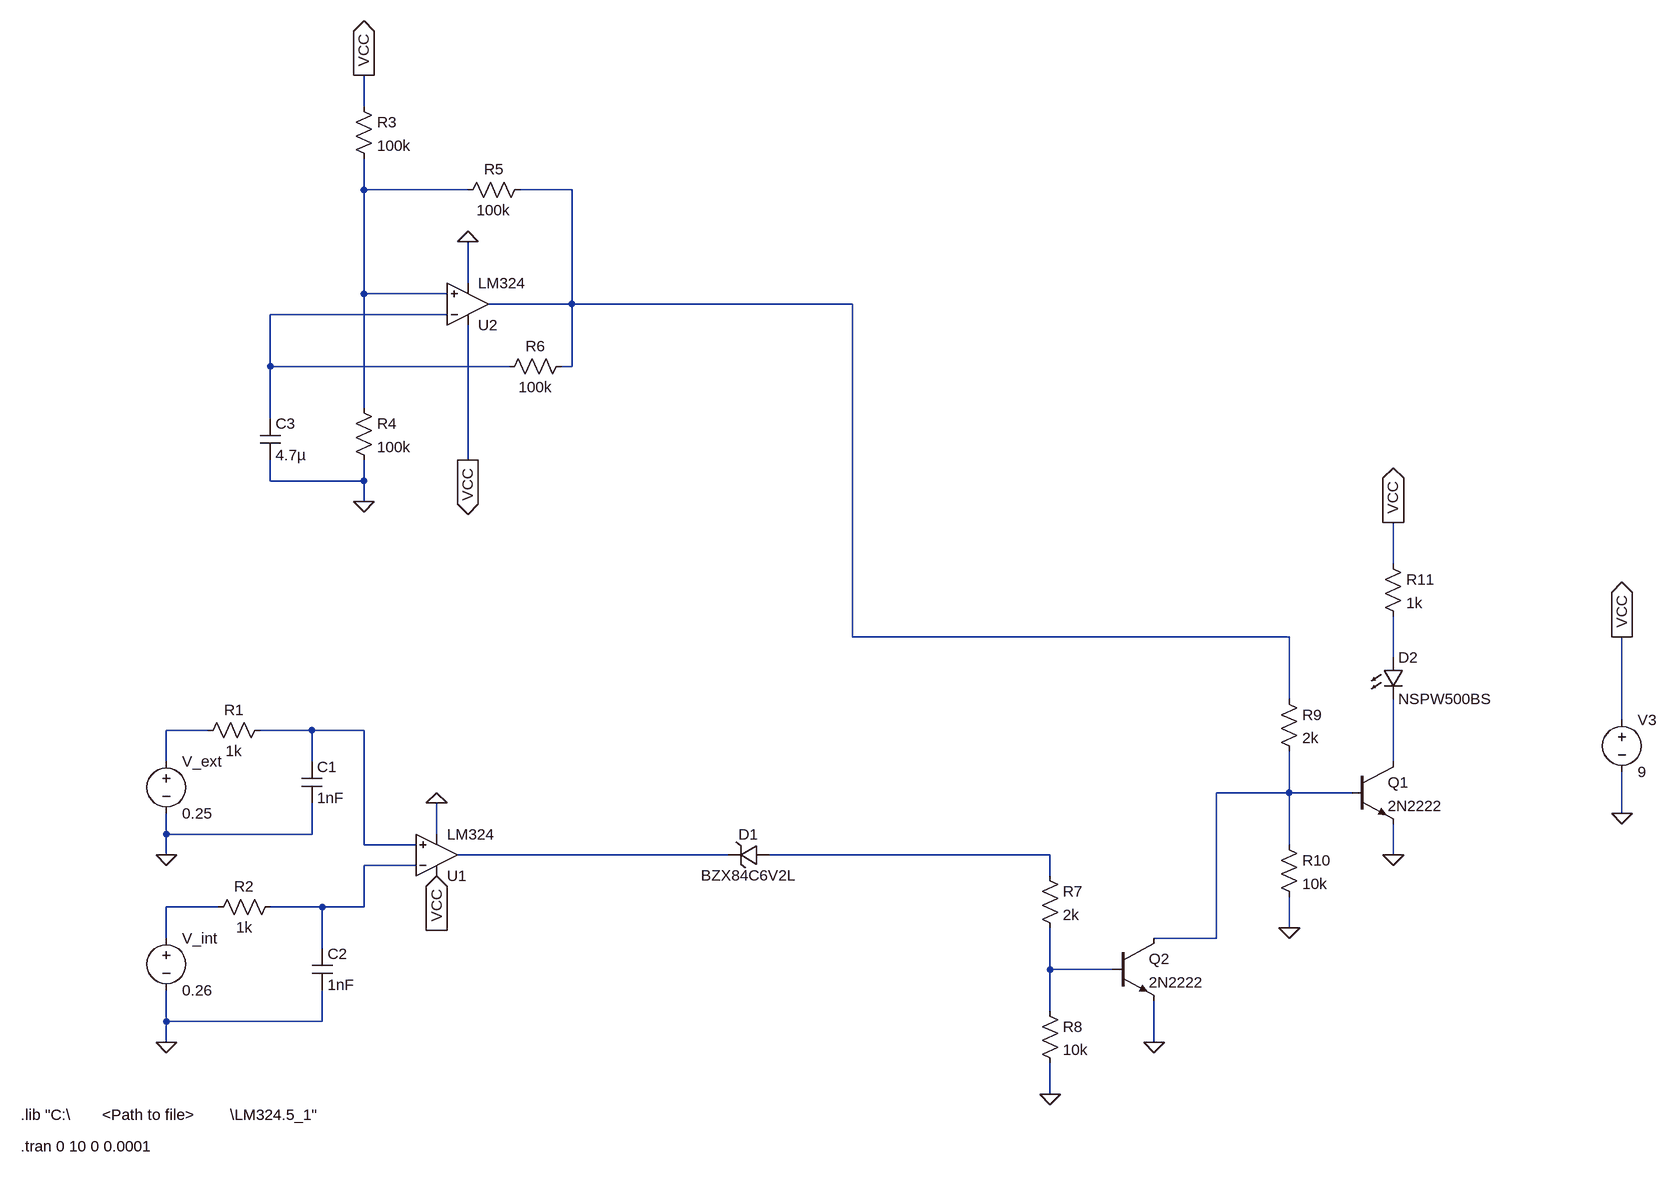
[diagram p0: schematic LT SPICE PROJECT.asc]
LT SPICE PROJECT.asc, the LTspice schematic file:
Version 4
SHEET 1 2552 820
WIRE 272 -912 272 -960
WIRE 272 -784 272 -832
WIRE 432 -784 272 -784
WIRE 592 -784 512 -784
WIRE 432 -640 432 -704
WIRE 272 -624 272 -784
WIRE 400 -624 272 -624
WIRE 592 -608 592 -784
WIRE 592 -608 464 -608
WIRE 1024 -608 592 -608
WIRE 400 -592 128 -592
WIRE 128 -512 128 -592
WIRE 496 -512 128 -512
WIRE 592 -512 592 -608
WIRE 592 -512 576 -512
WIRE 272 -448 272 -624
WIRE 128 -432 128 -512
WIRE 432 -368 432 -576
WIRE 128 -336 128 -368
WIRE 272 -336 272 -368
WIRE 272 -336 128 -336
WIRE 272 -304 272 -336
WIRE 1856 -208 1856 -272
WIRE 1024 -96 1024 -608
WIRE 1696 -96 1024 -96
WIRE 1856 -64 1856 -128
WIRE 1696 0 1696 -96
WIRE 2208 32 2208 -96
WIRE 32 48 -32 48
WIRE 192 48 112 48
WIRE 272 48 192 48
WIRE -32 96 -32 48
WIRE 192 96 192 48
WIRE 1856 96 1856 0
WIRE 1696 144 1696 80
WIRE 1696 144 1584 144
WIRE 1792 144 1696 144
WIRE 2208 176 2208 112
WIRE -32 208 -32 176
WIRE 192 208 192 160
WIRE 192 208 -32 208
WIRE 384 208 384 160
WIRE 272 224 272 48
WIRE 352 224 272 224
WIRE 1696 224 1696 144
WIRE -32 240 -32 208
WIRE 832 240 416 240
WIRE 1328 240 896 240
WIRE 1856 240 1856 192
WIRE 352 256 272 256
WIRE 1328 272 1328 240
WIRE 48 320 -32 320
WIRE 208 320 128 320
WIRE 272 320 272 256
WIRE 272 320 208 320
WIRE 1696 352 1696 304
WIRE -32 368 -32 320
WIRE 1584 368 1584 144
WIRE 1584 368 1488 368
WIRE 208 384 208 320
WIRE 1328 416 1328 352
WIRE 1424 416 1328 416
WIRE 1328 480 1328 416
WIRE -32 496 -32 448
WIRE 208 496 208 448
WIRE 208 496 -32 496
WIRE -32 528 -32 496
WIRE 1488 528 1488 464
WIRE 1328 608 1328 560
FLAG -32 240 0
FLAG -32 528 0
FLAG 384 160 0
FLAG 432 -704 0
FLAG 272 -304 0
FLAG 1328 608 0
FLAG 1488 528 0
FLAG 1856 240 0
FLAG 2208 176 0
FLAG 384 272 VCC
IOPIN 384 272 In
FLAG 2208 -96 VCC
IOPIN 2208 -96 Out
FLAG 432 -368 VCC
IOPIN 432 -368 Out
FLAG 272 -960 VCC
IOPIN 272 -960 Out
FLAG 1856 -272 VCC
IOPIN 1856 -272 Out
FLAG 1696 352 0
SYMBOL voltage -32 80 R0
WINDOW 123 0 0 Left 0
WINDOW 39 24 124 Left 2
SYMATTR InstName V_ext
SYMATTR Value 0.25
SYMBOL voltage -32 352 R0
WINDOW 123 0 0 Left 0
WINDOW 39 24 124 Left 2
SYMATTR InstName V_int
SYMATTR Value 0.26
SYMBOL cap 176 96 R0
SYMATTR InstName C1
SYMATTR Value 1nF
SYMBOL cap 192 384 R0
SYMATTR InstName C2
SYMATTR Value 1nF
SYMBOL res 128 32 R90
WINDOW 0 0 56 VBottom 2
WINDOW 3 32 56 VTop 2
SYMATTR InstName R1
SYMATTR Value 1k
SYMATTR SpiceLine tol=5
SYMBOL res 144 304 R90
WINDOW 0 0 56 VBottom 2
WINDOW 3 32 56 VTop 2
SYMATTR InstName R2
SYMATTR Value 1k
SYMATTR SpiceLine tol=5
SYMBOL Opamps\\opamp2 384 304 M180
SYMATTR InstName U1
SYMATTR Value LM324
SYMBOL Opamps\\opamp2 432 -544 M180
SYMATTR InstName U2
SYMATTR Value LM324
SYMBOL res 256 -928 R0
SYMATTR InstName R3
SYMATTR Value 100k
SYMATTR SpiceLine tol=5
SYMBOL res 528 -800 R90
WINDOW 0 0 56 VBottom 2
WINDOW 3 32 56 VTop 2
SYMATTR InstName R5
SYMATTR Value 100k
SYMBOL cap 112 -432 R0
SYMATTR InstName C3
SYMATTR Value 4.7µ
SYMBOL res 256 -464 R0
SYMATTR InstName R4
SYMATTR Value 100k
SYMATTR SpiceLine tol=5
SYMBOL res 592 -528 R90
WINDOW 0 0 56 VBottom 2
WINDOW 3 32 56 VTop 2
SYMATTR InstName R6
SYMATTR Value 100k
SYMATTR SpiceLine tol=5
SYMBOL npn 1792 96 R0
SYMATTR InstName Q1
SYMATTR Value 2N2222
SYMBOL npn 1424 368 R0
SYMATTR InstName Q2
SYMATTR Value 2N2222
SYMBOL res 1312 256 R0
SYMATTR InstName R7
SYMATTR Value 2k
SYMATTR SpiceLine tol=5
SYMBOL res 1312 464 R0
SYMATTR InstName R8
SYMATTR Value 10k
SYMATTR SpiceLine tol=5
SYMBOL res 1680 208 R0
SYMATTR InstName R10
SYMATTR Value 10k
SYMATTR SpiceLine tol=5
SYMBOL res 1680 -16 R0
SYMATTR InstName R9
SYMATTR Value 2k
SYMATTR SpiceLine tol=5
SYMBOL LED 1840 -64 R0
SYMATTR InstName D2
SYMATTR Value NSPW500BS
SYMBOL res 1840 -224 R0
SYMATTR InstName R11
SYMATTR Value 1k
SYMBOL voltage 2208 16 R0
SYMATTR InstName V3
SYMATTR Value 9
SYMBOL zener 896 224 R90
WINDOW 0 0 32 VBottom 2
WINDOW 3 32 32 VTop 2
SYMATTR InstName D1
SYMATTR Value BZX84C6V2L
SYMATTR Description Diode
SYMATTR Type diode
TEXT -256 640 Left 2 !.lib "C:\\       <Path to file>        \\LM324.5_1"
TEXT -256 688 Left 2 !.tran 0 10 0 0.0001

The netlist it stands for:
* LT SPICE PROJECT.asc
V_ext N005 0 0.25
V_int N012 0 0.26
C1 N006 0 1nF
C2 N011 0 1nF
R1 N006 N005 1k tol=5
R2 N011 N012 1k tol=5
XU1 N006 N011 VCC 0 N009 LM324  ; pins In+ In- V+ V- OUT
XU2 N001 N003 VCC 0 N002 LM324  ; pins In+ In- V+ V- OUT
R3 VCC N001 100k tol=5
R5 N002 N001 100k
C3 N003 0 4.7µ
R4 N001 0 100k tol=5
R6 N002 N003 100k tol=5
Q1 N007 N008 0 0 2N2222
Q2 N008 N013 0 0 2N2222
R7 N010 N013 2k tol=5
R8 N013 0 10k tol=5
R10 N008 0 10k tol=5
R9 N002 N008 2k tol=5
D2 N004 N007 NSPW500BS
R11 VCC N004 1k
V3 VCC 0 9
D1 N010 N009 BZX84C6V2L
.model D D
.lib standard.dio
.model NPN NPN
.model PNP PNP
.lib standard.bjt
.lib "C:\       <Path to file>        \LM324.5_1"
.tran 0 10 0 0.0001
.backanno
.end